# Altium schematic sheet ETH_PHY_RMII.SchDoc: =ProjectName
size 420 x 297 mm; Author: T.P.; CompanyName: WUT; DrawnBy: T.P.; Organization: WUT ISE; Address1: Warsaw Univeristy of Technology; Address2: Nowowiejska 15/19; DocumentNumber: 14; Revision: 0.9; SheetNumber: 14; SheetTotal: 36; EDA_Number: ARTIQ; Projet: ARTIQ/SINARA; ModifiedBy: -; CreateDate: XX/XX/XXXX; CheckedDate: -; Title2: ETH_PHY_RMII.SchDoc; DivGrp: ISE; Designer: G.K. and T.P.; ModifiedDate: -; ProjectName: ADC/DAC MEZZANINE
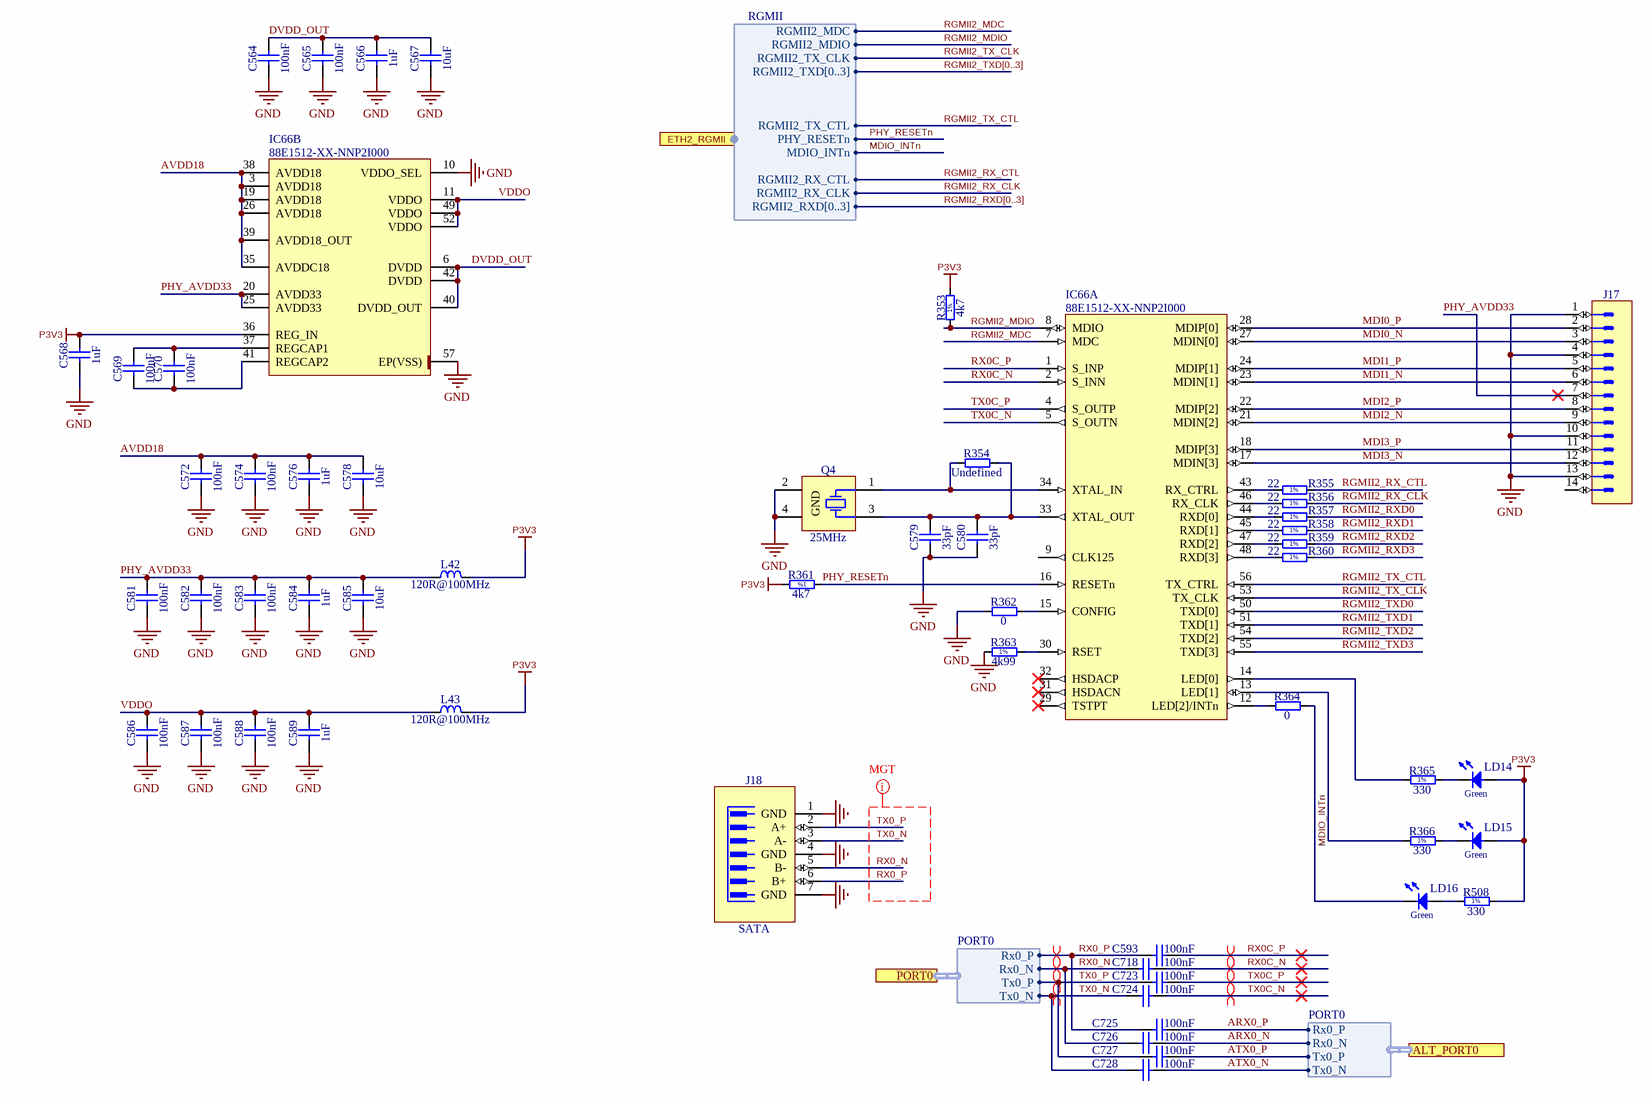
[diagram p0: ETH_PHY_RMII.SchDoc]

## Parts
C564  100nF  [CAPC0603X33N]
C565  100nF  [CAPC0603X33N]
C566  1uF  [CAPC1005X55N]
C567  10uF  [CAPC1608X87N]
C568  1uF  [CAPC1005X55N]
C569  100nF  [CAPC0603X33N]
C570  100nF  [CAPC0603X33N]
C572  100nF  [CAPC0603X33N]
C574  100nF  [CAPC0603X33N]
C576  1uF  [CAPC1005X55N]
C578  10uF  [CAPC1608X87N]
C579  33pF  [CAPC1005X55N]
C580  33pF  [CAPC1005X55N]
C581  100nF  [CAPC0603X33N]
C582  100nF  [CAPC0603X33N]
C583  100nF  [CAPC0603X33N]
C584  1uF  [CAPC1005X55N]
C585  10uF  [CAPC1608X87N]
C586  100nF  [CAPC0603X33N]
C587  100nF  [CAPC0603X33N]
C588  100nF  [CAPC0603X33N]
C589  1uF  [CAPC1005X55N]
C593  100nF  [CAPC0603X33N]
C718  100nF  [CAPC0603X33N]
C723  100nF  [CAPC0603X33N]
C724  100nF  [CAPC0603X33N]
C725  100nF  [CAPC0603X33N]
C726  100nF  [CAPC0603X33N]
C727  100nF  [CAPC0603X33N]
C728  100nF  [CAPC0603X33N]
IC66  88E1512-XX-NNP2I000  [QFN50P800X800X100-57N-S437]  (parts A,B of 2)
J17  Milli-Grid™  [MOLEX_87832-1420]  (value not drawn)
J18  SATA  [MOLEX_67800-5005]
L42  120R@100MHz  [INDC1005X55N]
L43  120R@100MHz  [INDC1005X55N]
LD14  Green  [LED_OSRAM_LGL29K]
LD15  Green  [LED_OSRAM_LGL29K]
LD16  Green  [LED_OSRAM_LGL29K]
Q4  25MHz  [XTAL_TXC_8Y]
R353  4k7  [RESC1005X40N]
R354  Undefined  [RESC1005X40N]
R355  22  [RESC1005X40N]
R356  22  [RESC1005X40N]
R357  22  [RESC1005X40N]
R358  22  [RESC1005X40N]
R359  22  [RESC1005X40N]
R360  22  [RESC1005X40N]
R361  4k7  [RESC1005X40N]
R362  0  [RESC1005X40N]
R363  4k99  [RESC1608X55N]
R364  0  [RESC1005X40N]
R365  330  [RESC1005X40N]
R366  330  [RESC1005X40N]
R508  330  [RESC1005X40N]

## Ports
ALT_PORT0 (harness PORT0), ETH2_RGMII (harness RGMII), PORT0 (harness PORT0)

## Harnesses
PORT0: Rx0_P, Rx0_N, Tx0_N, Tx0_P
RGMII: RGMII2_MDC, RGMII2_MDIO, RGMII2_TX_CLK, RGMII2_TXD[0..3], RGMII2_TX_CTL, RGMII2_RX_CTL, RGMII2_RX_CLK, RGMII2_RXD[0..3], MDIO_INTn, PHY_RESETn

## Nets
GND: C564.1 C565.1 C566.1 C567.1 C568.1 C572.1 C574.1 C576.1 C578.1 C579.1 C580.1 C581.1 C582.1 C583.1 C584.1 C585.1 C586.1 C587.1 C588.1 C589.1 IC66.10(VDDO_SEL) IC66.57(EP(VSS)) J17.1 J17.4 J17.10 J17.13 J18.1(GND) J18.4(GND) J18.7(GND) Q4.2(GND) Q4.4(GND) R362.1 R363.1
P3V3: C568.2 IC66.36(REG_IN) L42.2 L43.2 LD14.2(A) LD15.2(A) R353.2 R361.2 R508.2
ARX0_N: C726.2 ; port ALT_PORT0.Rx0_N
ARX0_P: C725.2 ; port ALT_PORT0.Rx0_P
ATX0_N: C728.2 ; port ALT_PORT0.Tx0_N
ATX0_P: C727.2 ; port ALT_PORT0.Tx0_P
AVDD18: C572.2 C574.2 C576.2 C578.2 IC66.3(AVDD18) IC66.19(AVDD18) IC66.26(AVDD18) IC66.35(AVDDC18) IC66.38(AVDD18) IC66.39(AVDD18_OUT)
DVDD_OUT: C564.2 C565.2 C566.2 C567.2 IC66.6(DVDD) IC66.40(DVDD_OUT) IC66.42(DVDD)
MDI0_N: IC66.27(MDIN[0]) J17.3
MDI0_P: IC66.28(MDIP[0]) J17.2
MDI1_N: IC66.23(MDIN[1]) J17.6
MDI1_P: IC66.24(MDIP[1]) J17.5
MDI2_N: IC66.21(MDIN[2]) J17.9
MDI2_P: IC66.22(MDIP[2]) J17.8
MDI3_N: IC66.17(MDIN[3]) J17.12
MDI3_P: IC66.18(MDIP[3]) J17.11
MDIO_INTn: LD16.1(C) R364.2 ; port ETH2_RGMII.MDIO_INTn
PHY_AVDD33: C581.2 C582.2 C583.2 C584.2 C585.2 IC66.20(AVDD33) IC66.25(AVDD33) J17.7 L42.1
PHY_RESETn: IC66.16(RESETn) R361.1 ; port ETH2_RGMII.PHY_RESETn
RGMII2_MDC: IC66.7(MDC) ; port ETH2_RGMII.RGMII2_MDC
RGMII2_MDIO: IC66.8(MDIO) R353.1 ; port ETH2_RGMII.RGMII2_MDIO
RGMII2_RX_CLK: R356.2 ; port ETH2_RGMII.RGMII2_RX_CLK
RGMII2_RX_CTL: R355.2 ; port ETH2_RGMII.RGMII2_RX_CTL
RGMII2_RXD0: R357.2
RGMII2_RXD1: R358.2
RGMII2_RXD2: R359.2
RGMII2_RXD3: R360.2
RGMII2_TX_CLK: IC66.53(TX_CLK) ; port ETH2_RGMII.RGMII2_TX_CLK
RGMII2_TX_CTL: IC66.56(TX_CTRL) ; port ETH2_RGMII.RGMII2_TX_CTL
RGMII2_TXD0: IC66.50(TXD[0])
RGMII2_TXD1: IC66.51(TXD[1])
RGMII2_TXD2: IC66.54(TXD[2])
RGMII2_TXD3: IC66.55(TXD[3])
RX0_N: C718.1 C726.1 J18.5(B-) ; port PORT0.Rx0_N
RX0_P: C593.1 C725.1 J18.6(B+) ; port PORT0.Rx0_P
RX0C_N: C718.2 IC66.2(S_INN)
RX0C_P: C593.2 IC66.1(S_INP)
TX0_N: C724.1 C728.1 J18.3(A-) ; port PORT0.Tx0_N
TX0_P: C723.1 C727.1 J18.2(A+) ; port PORT0.Tx0_P
TX0C_N: C724.2 IC66.5(S_OUTN)
TX0C_P: C723.2 IC66.4(S_OUTP)
VDDO: C586.2 C587.2 C588.2 C589.2 IC66.11(VDDO) IC66.49(VDDO) IC66.52(VDDO) L43.1
NetC569_1: C569.1 C570.1 IC66.41(REGCAP2)
NetC569_2: C569.2 C570.2 IC66.37(REGCAP1)
NetC579_2: C579.2 C580.2 IC66.33(XTAL_OUT) Q4.3(X) R354.2
NetIC66_12: IC66.12(LED[2]/INTn) R364.1
NetIC66_13: IC66.13(LED[1]) R366.1
NetIC66_14: IC66.14(LED[0]) R365.1
NetIC66_15: IC66.15(CONFIG) R362.2
NetIC66_30: IC66.30(RSET) R363.2
NetIC66_34: IC66.34(XTAL_IN) Q4.1(X) R354.1
NetIC66_43: IC66.43(RX_CTRL) R355.1
NetIC66_44: IC66.44(RXD[0]) R357.1
NetIC66_45: IC66.45(RXD[1]) R358.1
NetIC66_46: IC66.46(RX_CLK) R356.1
NetIC66_47: IC66.47(RXD[2]) R359.1
NetIC66_48: IC66.48(RXD[3]) R360.1
NetLD14_1: LD14.1(C) R365.2
NetLD15_1: LD15.1(C) R366.2
NetLD16_2: LD16.2(A) R508.1

Not connected (* = marked no-connect by the designer): IC66 9(CLK125) 29(TSTPT)* 31(HSDACN)* 32(HSDACP)*; J17 14

## Buses and harness runs
bus RGMII2_RXD[0..3]
bus RGMII2_TXD[0..3]

## Layout directives
differential pair; differential pair class Diff_100Ohm: RX0_N, RX0_P, RX0C_N, RX0C_P, TX0_N, TX0_P, TX0C_N, TX0C_P
net class MGT: RX0_N, RX0_P, TX0_N, TX0_P

## Notes on the sheet
- Project/Equipment
- Document
- Designer
- Drawn by
- Check.by
- File
- Last Mod.
- Print Date
- Sheet
- Size
- A3
- of
- Rev
- (in symbol R0402_4K7_1%_0.0625W_100PPM) 1%
- (in symbol R0402_22R_1%_0.0625W_100PPM) 1%
- (in symbol R0402_330R_1%_0.0625W_100PPM) 1%
- (in symbol R0603_4K99_1%_0.063W_50PPM) 1%

## Library data of the parts
C564 C565 C569 C570 C572 C574 C581-C583 C586-C588 C593 C718 C723-C728 = CC0201_100NF_6.3V_10%_X5R: Non-polarised capacitor; Manufacturer: GENERIC; Part Description: SMD Multilayer Chip Ceramic Capacitor; Manufacturer1 Part Number: 02016D104KAT2A; Tolerance: ±10%; Voltage: 6.3V; TC: X5R; Manufacturer Part Number: CC0201_100NF_6.3V_10%_X5R; Part Number: CC0201_100NF_6.3V_10%_X5R; Value: 100nF; Component Kind: Standard; Component Type: Standard; Pin Count: 2; Status: Not Recommended; Case: 0201; Mounted: Yes; Socket: No; SMD: Yes; Sense: No; Manufacturer1 Example: AVX; Manufacturer1 ComponentHeight: 0.33mm; HelpURL: \\cern.ch\dfs\Applications\Altium\Datasheets\CC0201_X5R_AVX.pdf; Author: CERN DEM JLC; CreateDate: 03.12.2007; LatestRevisionDate: 03.12.2007
C566 C568 C576 C584 C589 = CC0402_1UF_16V_10%_X5R: Non-polarised capacitor; Manufacturer: GENERIC; Part Description: SMD Multilayer Chip Ceramic Capacitor; Manufacturer1 Part Number: C1005X5R1C105KT; Tolerance: ±10%; Voltage: 16V; TC: X5R; Manufacturer Part Number: CC0402_1UF_16V_10%_X5R; Part Number: CC0402_1UF_16V_10%_X5R; Value: 1uF; Component Kind: Standard; Component Type: Standard; Pin Count: 2; Status: Preferred; Case: 0402; Mounted: Yes; Socket: No; SMD: Yes; Sense: No; Manufacturer1 Example: TDK; Manufacturer1 ComponentHeight: 0.55mm; HelpURL: \\cern.ch\dfs\Applications\Altium\Datasheets\CC0402_X5R_TDK_C.pdf; Author: CERN DEM JLC; CreateDate: 25.10.2012; LatestRevisionDate: 25.10.2012
C567 C578 C585 = CC0603_10uF_6.3V_20%_X5R: Non-polarised capacitor; Manufacturer: GENERIC; Manufacturer1 Part Number: C0603C106M9PAC; Part Description: SMD Multilayer Chip Ceramic Capacitor; TC: X5R; Tolerance: ±20%; Voltage: 6.3V; Author: CERN DEM JLC; Case: 0603; Component Kind: Standard; Component Type: Standard; CreateDate: 03.12.2007; HelpURL: \\cern.ch\dfs\Applications\Altium\Datasheets\CC0603_X5R_KEMET.pdf; LatestRevisionDate: 03.12.2007; Manufacturer Part Number: CC0603_10uF_6.3V_20%_X5R; Manufacturer1 ComponentHeight: 0.95mm; Manufacturer1 Example: KEMET; Mounted: Yes; Part Number: CC0603_10UF_6.3V_20%_X5R; Pin Count: 2; SMD: Yes; Socket: No; Status: Preferred; Value: 10uF; Sense: No
C579 C580 = CC0402_33PF_50V_5%_C0G: Non-polarised capacitor; Part Description: SMD Multilayer Chip Ceramic Capacitor; Manufacturer: GENERIC; Manufacturer1 Part Number: C0402C330J5GACTU; Voltage: 50V; TC: C0G/NP0; Tolerance: ±5%; Part Number: CC0402_33PF_50V_5%_C0G; Component Kind: Standard; Component Type: Standard; Pin Count: 2; Value: 33pF; Status: Preferred; Manufacturer Part Number: CC0402_33PF_50V_5%_C0G; Case: 0402; Mounted: Yes; Socket: No; SMD: Yes; Sense: No; Manufacturer1 Example: KEMET; Manufacturer1 ComponentHeight: 0.55mm; HelpURL: \\cern.ch\dfs\Applications\Altium\Datasheets\CC0805_C0G_KEMET_(Commercial Grade).pdf; Author: CERN DEM JLC; CreateDate: 03.12.2007; LatestRevisionDate: 22.04.2015
IC66 = 88E1512-XX-NNP2I000: Alaska Integrated 10/100/1000 Mbps Energy Efficient Ethernet Transceiver; Manufacturer: MARVELL  TECHNOLOGY; PressFit: No; Bonding: No; Part Number: 88E1512-XX-NNP2I000; Component Kind: Standard; Component Type: Standard; Device: 88E1512-XX-NNP2I000; PackageDescription: QFN, 0.50mm Pitch, Square; 56 Pin, 8.00mm L X 8.00mm W X 1.00mm H Body (4.37mm X 4.37mm Thermal Tab), IPC Medium Density; Part Description: Alaska Integrated 10/100/1000 Mbps Energy Efficient Ethernet Transceiver; Manufacturer Part Number: 88E1512-XX-NNP2I000; Pin Count: 57; Case: QFN56; Mounted: Yes; Socket: No; SMD: Yes; Sense: No; ComponentHeight: 1mm; Author: CERN DEM JLC; HelpURL: \\cern.ch\dfs\Applications\Altium\Datasheets\88E1512-XX-NNP2I000.pdf; CreateDate: 21.01.2015; LatestRevisionDate: 21.01.2015
J17 = MOLEX_87832-1420: Connector 14 Male; Part Description: 2.00mm (.079") Pitch Milli-Grid™ Header, Surface Mount, Vertical, Shrouded, 14 Circuits,with Locking Windows and Centre Polarization Slot, PCB Locator; Manufacturer: MOLEX; PressFit: No; Part Number: MOLEX_87832-1420; Component Kind: Standard; Component Type: Standard; Pin Count: 14; Family: Milli-Grid™; Mounted: Yes; Socket: No; SMD: Yes; Sense: No; Status: None; Manufacturer Part Number: 87832-1420; ComponentHeight: 7.6mm; HelpURL: \\cern.ch\dfs\Applications\Altium\Datasheets\MOLEX_87832-1420.pdf; Author: CERN DEM JLC; CreateDate: 09.09.2008; LatestRevisionDate: 09.09.2008
J18 = MOLEX_67800-5005: 7 Pin SATA Receptacle; Part Description: 1.27mm Pitch, 7 Contacts, Serial ATA High Speed Header, Straight with Locking Latch; Manufacturer: MOLEX; PressFit: No; Part Number: MOLEX_67800-5005; Component Kind: Standard; Component Type: Standard; Pin Count: 7; Family: SATA; Mounted: Yes; Socket: No; SMD: Yes; Sense: No; Status: None; Manufacturer Part Number: 67800-5005; ComponentHeight: 8.4mm; HelpURL: \\cern.ch\dfs\Applications\Altium\Datasheets\MOLEX_67800-5005.pdf; Author: CERN DEM MR; CreateDate: 01.12.2016; LatestRevisionDate: 01.12.2016
L42 L43 = IND0402_MURATA_BLM15PX121SN1D: Inductor; Manufacturer: MURATA; Part Description: SMD EMIFIL Chip Ferrite Bead; Tolerance: ±25%; Power: 2A; Resistance: 0.055R; Manufacturer Part Number: BLM15PX121SN1D; Part Number: IND0402_MURATA_BLM15PX121SN1D; Value: 120R@100MHz; Component Kind: Standard; Component Type: Standard; Pin Count: 2; Status: None; Case: 0402; Mounted: Yes; Socket: No; SMD: Yes; Sense: No; ComponentHeight: 0.55mm; HelpURL: \\cern.ch\dfs\Applications\Altium\Datasheets\IND0402_MURATA_BLM15PX.pdf; Author: CERN DEM JMW; CreateDate: 19.02.2014; LatestRevisionDate: 19.02.2014
LD14-LD16 = LED_OSRAM_LG L29K-G2J1-24-Z: LED Green 1C 2A; Manufacturer: OSRAM; Part Description: Surface Mount Green LED (0603 Case); Bonding: No; PressFit: No; Status Comment: Sourcing Difficulty; Author: CERN DEM JLC; Case: 0603; Color: Green; Component Kind: Standard; Component Type: Standard; ComponentHeight: 0.67mm; CreateDate: 24.04.2012; HelpURL: \\cern.ch\dfs\Applications\Altium\Datasheets\LED_OSRAM_LGL29K.pdf; LatestRevisionDate: 24.04.2012; Manufacturer Part Number: LG L29K-G2J1-24-Z; Mounted: Yes; PackageDescription: Green Chip LED, 2-Leads, Body 1.7x0.8mm, IPC Medium Density; Part Number: LED_OSRAM_LG L29K-G2J1-24-Z; Pin Count: 2; SMD: Yes; Socket: No; Status: Not Recommended; Sense: No
Q4 = XTAL_25MHZ_TXC_8Y-25.000MAAJ-T: Crystal 4 pins 1=XTAL Control 2=GND3=XTAL 4=GND; Part Description: ±30ppm 18pF -20°C to +70°C  4 Pins, 2x1.6X0.5mm, SMD Seam Sealing Crystal, 8Y Serie; Manufacturer: TXC CORPORATION; PressFit: No; Bonding: No; Part Number: XTAL_25MHZ_TXC_8Y-25.000MAAJ-T; Component Kind: Standard; Component Type: Standard; PackageDescription: 4 Pins, 2x1.6X0.5mm, SMD Seam Sealing Crystal, 8Y Serie; Value: 25MHz; Manufacturer Part Number: 8Y-25.000MAAJ-T; Pin Count: 4; Mounted: Yes; Socket: No; SMD: Yes; Sense: No; ComponentHeight: 13.6mm; HelpURL: \\cern.ch\dfs\Applications\Altium\Datasheets\XTAL_TXC_8Y.pdf; Author: CERN DEM JLC; CreateDate: 08.03.2012; LatestRevisionDate: 08.03.2012
R353 = R0402_4K7_1%_0.0625W_100PPM: Resistor - 1%; Part Description: General Purpose Thick Film Chip Resistor; Manufacturer: GENERIC; Manufacturer1 Part Number: 232270674702L; TC: ±100ppm/°C; PressFit: No; Part Number: R0402_4K7_1%_0.0625W_100PPM; Component Kind: Standard; Component Type: Standard; Pin Count: 2; Value: 4k7; Status: Not Recommended; Power: 0.0625W; Tolerance: ±1%; Manufacturer Part Number: R0402_4K7_1%_0.0625W_100PPM; Case: 0402; Mounted: Yes; Sense: No; Socket: No; SMD: Yes; Manufacturer1 Example: YAGEO PHYCOMP; Manufacturer1 ComponentHeight: 0.4mm; HelpURL: \\cern.ch\dfs\Applications\Altium\Datasheets\R0402_Phycomp_RC0402.pdf; Author: CERN DEM JLC; CreateDate: 03.12.2007; LatestRevisionDate: 17.10.2012
R354 R362 R364 = R0402_0R_JUMPER: Resistor; Manufacturer: GENERIC; Part Description: 1A (0.05R Max DC Resistance) Zero Ohm Jumper; Manufacturer1 Part Number: 232270591001L; PressFit: No; Manufacturer Part Number: R0402_0R_JUMPER; Part Number: R0402_0R_JUMPER; Component Kind: Standard; Component Type: Standard; Pin Count: 2; Status: Not Recommended; Case: 0402; Mounted: Yes; Sense: No; Socket: No; SMD: Yes; Manufacturer1 Example: YAGEO PHYCOMP; Manufacturer1 ComponentHeight: 0.4mm; HelpURL: \\cern.ch\dfs\Applications\Altium\Datasheets\R0402_Phycomp_RC0402.pdf; Author: CERN DEM JLC; CreateDate: 03.12.2007; LatestRevisionDate: 17.10.2012
  R354: Value: Undefined
  R362 R364: Value: 0
R355-R360 = R0402_22R_1%_0.0625W_100PPM: Resistor - 1%; Part Description: General Purpose Thick Film Chip Resistor; Manufacturer: GENERIC; Manufacturer1 Part Number: 232270672209L; TC: ±100ppm/°C; PressFit: No; Part Number: R0402_22R_1%_0.0625W_100PPM; Component Kind: Standard; Component Type: Standard; Pin Count: 2; Value: 22; Status: Not Recommended; Power: 0.0625W; Tolerance: ±1%; Manufacturer Part Number: R0402_22R_1%_0.0625W_100PPM; Case: 0402; Mounted: Yes; Sense: No; Socket: No; SMD: Yes; Manufacturer1 Example: YAGEO PHYCOMP; Manufacturer1 ComponentHeight: 0.4mm; HelpURL: \\cern.ch\dfs\Applications\Altium\Datasheets\R0402_Phycomp_RC0402.pdf; Author: CERN DEM JLC; CreateDate: 03.12.2007; LatestRevisionDate: 17.10.2012
R361 = R0402_4K7_1%_0.0625W_100PPM: Resistor - 1%; Manufacturer: GENERIC; Part Description: General Purpose Thick Film Chip Resistor; Manufacturer1 Part Number: 232270674702L; TC: ±100ppm/°C; PressFit: No; Manufacturer Part Number: R0402_4K7_1%_0.0625W_100PPM; Part Number: R0402_4K7_1%_0.0625W_100PPM; Tolerance: ±1%; Value: 4k7; Component Kind: Standard; Component Type: Standard; Pin Count: 2; Status: Not Recommended; Power: 0.0625W; Case: 0402; Mounted: Yes; Sense: No; Socket: No; SMD: Yes; Manufacturer1 Example: YAGEO PHYCOMP; Manufacturer1 ComponentHeight: 0.4mm; HelpURL: \\cern.ch\dfs\Applications\Altium\Datasheets\R0402_Phycomp_RC0402.pdf; Author: CERN DEM JLC; CreateDate: 03.12.2007; LatestRevisionDate: 17.10.2012
R363 = R0603_4K99_1%_0.063W_50PPM: Resistor - 1%; Manufacturer: GENERIC; Part Description: General Purpose Thick Film Chip Resistor; Manufacturer1 Part Number: CPF0603F4K99C1; Power: 0.1W; TC: ±50ppm/°C; PressFit: No; Manufacturer Part Number: R0603_4K99_1%_0.063W_50PPM; Part Number: R0603_4K99_1%_0.063W_50PPM; Tolerance: ±1%; Value: 4k99; Component Kind: Standard; Component Type: Standard; Pin Count: 2; Status: None; Case: 0603; Mounted: Yes; Sense: No; Socket: No; SMD: Yes; Manufacturer1 Example: TYCO NEOHM; Manufacturer1 ComponentHeight: 0.55mm; HelpURL: \\cern.ch\dfs\Applications\Altium\Datasheets\R0603_TYCO_CPF.pdf; Author: CERN DEM JLC; CreateDate: 20.05.2010; LatestRevisionDate: 20.05.2010
R365 R366 R508 = R0402_330R_1%_0.0625W_100PPM: Resistor - 1%; Manufacturer: GENERIC; Part Description: General Purpose Thick Film Chip Resistor; Manufacturer1 Part Number: 232270673301L; TC: ±100ppm/°C; PressFit: No; Manufacturer Part Number: R0402_330R_1%_0.0625W_100PPM; Part Number: R0402_330R_1%_0.0625W_100PPM; Tolerance: ±1%; Value: 330; Component Kind: Standard; Component Type: Standard; Pin Count: 2; Status: Not Recommended; Power: 0.0625W; Case: 0402; Mounted: Yes; Sense: No; Socket: No; SMD: Yes; Manufacturer1 Example: YAGEO PHYCOMP; Manufacturer1 ComponentHeight: 0.4mm; HelpURL: \\cern.ch\dfs\Applications\Altium\Datasheets\R0402_Phycomp_RC0402.pdf; Author: CERN DEM JLC; CreateDate: 03.12.2007; LatestRevisionDate: 17.10.2012